# Altium schematic sheet 25.SchDoc
size 513 x 386 mm
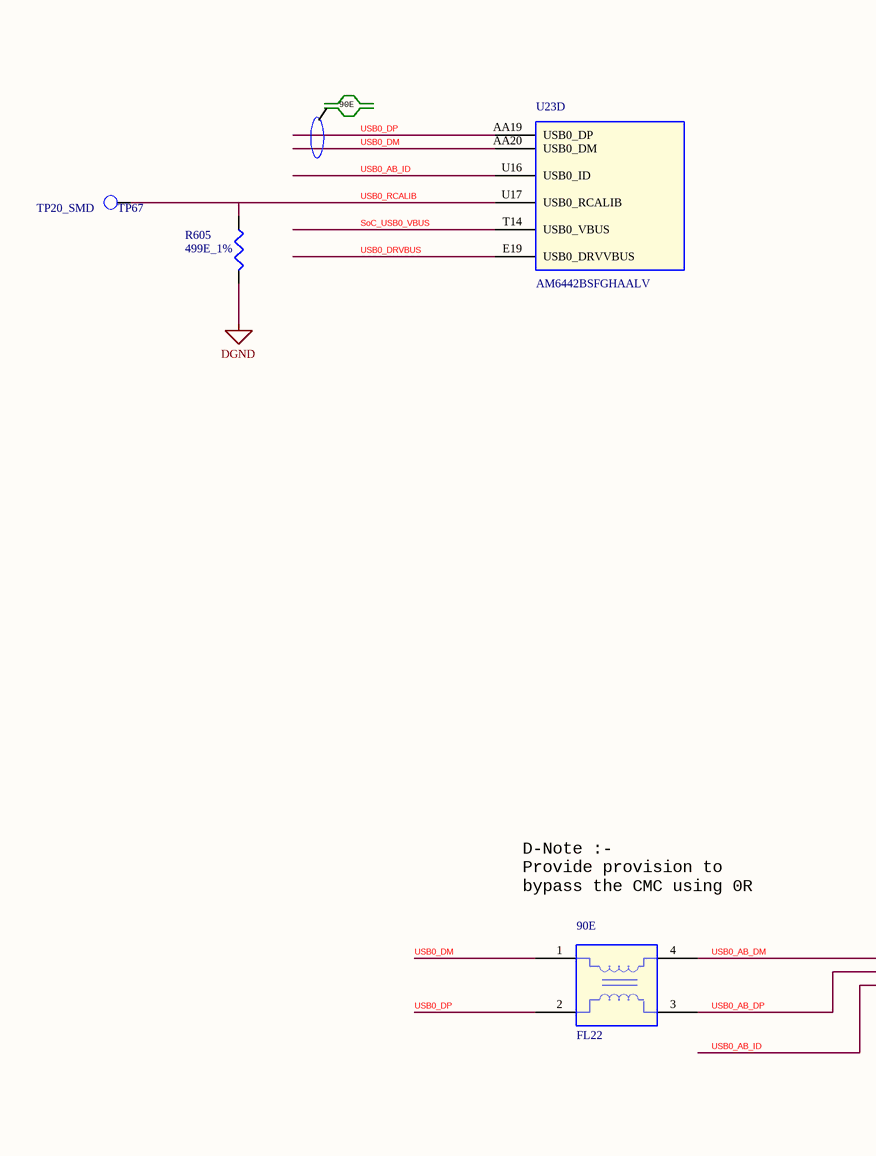
[diagram p0: 25.SchDoc, left]
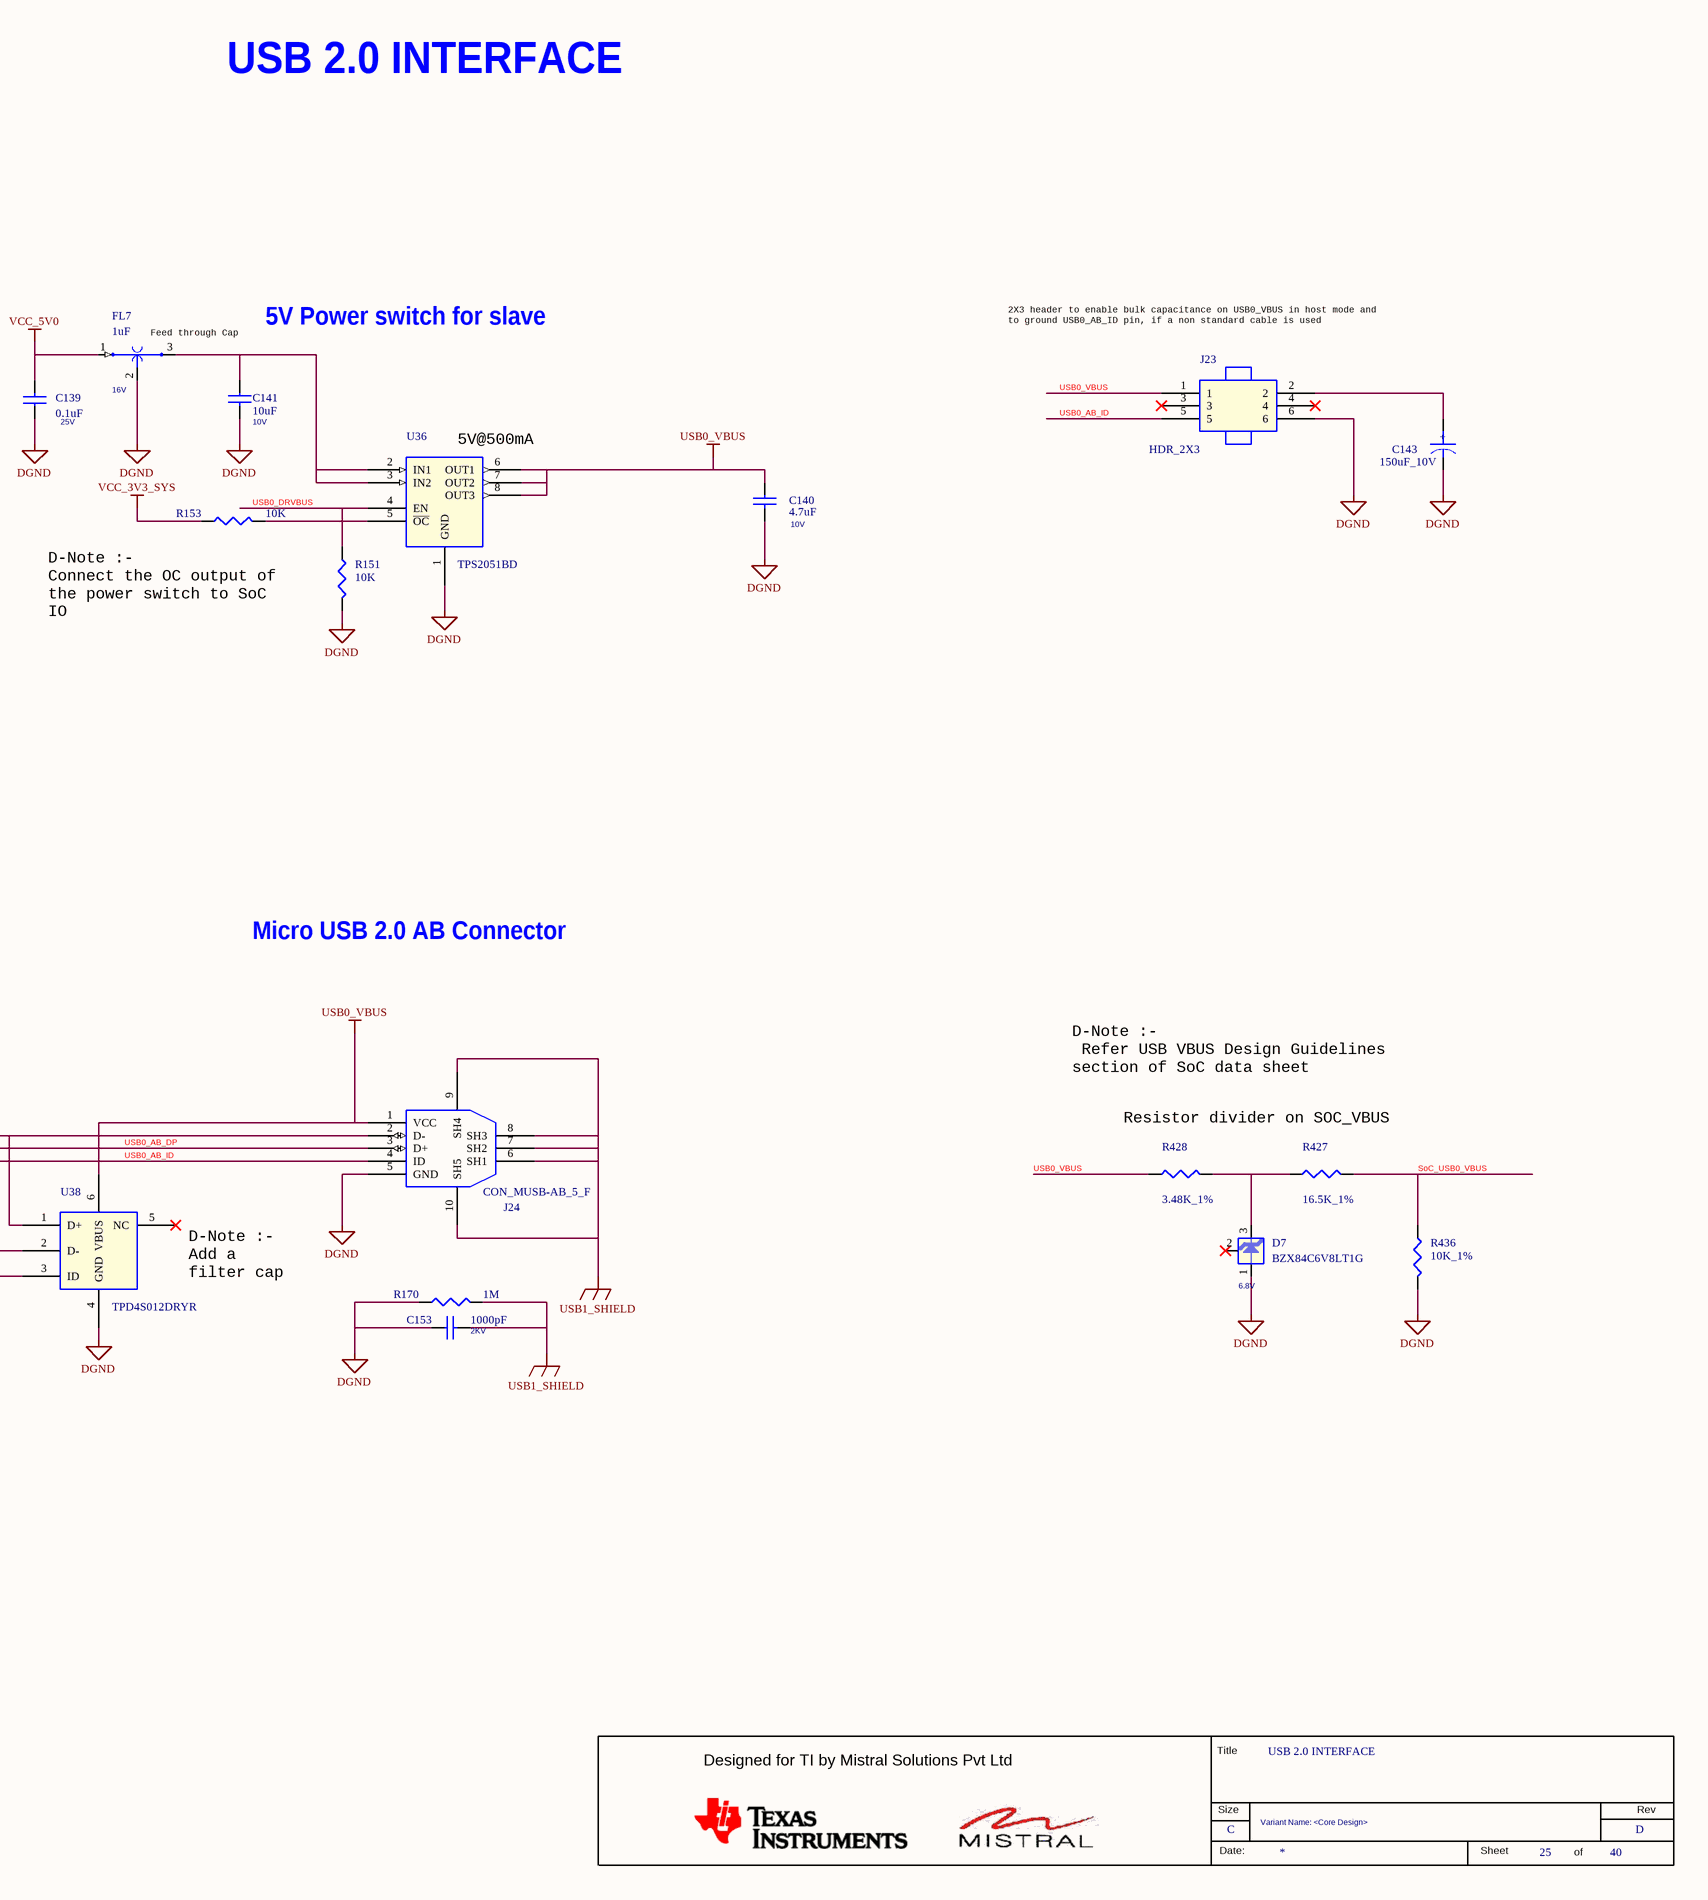
[diagram p1: 25.SchDoc, right]

## Parts
*  RevCode: D  Title: USB 2.0 INTERFACE  Page Size: C  Page Number: 25  Page Count: 40  Variant Name: <Core Design>  (hidden comment: MISTRAL_TITLEBLK_CSIZE)  (graphical)
C139  0.1uF  Voltage: 25V  [CAP0402_0-75]
C140  4.7uF  Voltage: 10V  [CAP0402_0-75]
C141  10uF  Voltage: 10V  [CAP0402_0-75]
C143  150uF_10V  [CAPT7343D_3-25]
C153  1000pF  Voltage: 2KV  [CAP1206_1-75]
D7  BZX84C6V8LT1G  Voltage: 6.8V  [SOT23-123_1-2]
FL7  1uF  Voltage: 16V  [FILT3_NFM21PC_0805_1]
FL22  90E  [IND4_ACM2012_90X50_SMD_1-3]
J23  HDR_2X3  [CON_3X2_SM_2MM]
J24  CON_MUSB-AB_5_F  [CON_USBAB5_ZX62RD-AB-5P8_S_R_S_3-2]
R151  10K  [RES0402_0-5]
R153  10K  [RES0402_0-5]
R170  1M  [RES0603_0-75]
R427  16.5K_1%  [RES0402_0-5]
R428  3.48K_1%  [RES0402_0-5]
R436  10K_1%  [RES0402_0-5]
R605  499E_1%  [RES0402_0-5]
TP67  TP20_SMD  [TP20_SMD]
U23  AM6442BSFGHAALV  [FCBGA441_31-49_680X680_2-6]  (part D of 16)
U36  TPS2051BD  [SOIC8_1-8]
U38  TPD4S012DRYR  [SON6_SN74LVC2G17_40X60_0-6]

## Nets
DGND: C139.1 C140.2 C141.2 C143.2 C153.1 D7.1(A) FL7.2(GND) J23.6 J24.5(GND) R151.2 R170.1 R436.2 R605.2 U36.1(GND) U38.4(GND)
USB0_VBUS: C140.1 J23.1 J24.1(VCC) R428.1 U36.6(OUT1) U36.7(OUT2) U36.8(OUT3) U38.6(VBUS)
USB1_SHIELD: C153.2 J24.6(SH1) J24.7(SH2) J24.8(SH3) J24.9(SH4) J24.10(SH5) R170.2
VCC_3V3_SYS: R153.1
VCC_5V0: C139.2 FL7.1(INPUT)
SoC_USB0_VBUS: R427.2 R436.1 U23.T14(USB0_VBUS)
USB0_AB_DM: FL22.4 J24.2(D-) U38.1(D+)
USB0_AB_DP: FL22.3 J24.3(D+) U38.2(D-)
USB0_AB_ID: J23.5 J24.4(ID) U23.U16(USB0_ID) U38.3(ID)
USB0_DM: FL22.1 U23.AA20(USB0_DM)
USB0_DP: FL22.2 U23.AA19(USB0_DP)
USB0_DRVBUS: R151.1 U23.E19(USB0_DRVVBUS) U36.4(EN)
USB0_RCALIB: R605.1 TP67.1(TP) U23.U17(USB0_RCALIB)
NetC141_1: C141.1 FL7.3(OUTPUT) U36.2(IN1) U36.3(IN2)
NetC143_1: C143.1 J23.2
NetD7_3: D7.3(C) R427.1 R428.2
NetR153_2: R153.2 U36.5(~{OC})

Not connected (* = marked no-connect by the designer): D7 2(NC)*; J23 3* 4*; U38 5(NC)*

## Notes on the sheet
- USB 2.0 INTERFACE
- 2X3 header to enable bulk capacitance on USB0_VBUS in host mode and
  to ground USB0_AB_ID pin, if a non standard cable is used
- 90E
- (near FL7) Feed through Cap
- 5V Power switch for slave
- (near U36) 5V@500mA
- (near R153) D-Note :-
  Connect the OC output of
  the power switch to SoC
  IO
- Micro USB 2.0 AB Connector
- D-Note :-
  Provide provision to
  bypass the CMC using 0R
- D-Note :-
  Refer USB VBUS Design Guidelines
  section of SoC data sheet
- Resistor divider on SOC_VBUS
- D-Note :-
  Add a
  filter cap
- (in symbol CAP_POL_Dup1) +
- (in symbol MISTRAL_TITLEBLK_CSIZE) Title; Designed for TI by Mistral Solutions Pvt Ltd; Size; Rev; Date:; Sheet; of

## Library data of the parts
* = MISTRAL_TITLEBLK_CSIZE: Issue: 1.0; Page Create Date: March  8, 1995; Page Modify Date: *
C139 = CAP_Dup3: CAP CERAMIC 0.1uF 25V 20% X5R 0402; Alt_Mfr_part_number: CC0402KRX5R8BB104; Mistral Part No: 120020080003-R; Mfr_name: WURTH ELECTRONICS; Mfr_part_number: 885012105018; Part_type: CAPACITORS\CERAMIC; Alt_Mfr_name: YAGEO AMERICA; Project: AM64x_EVM_BRD; Wattage: NA; Customs_HS_Code: 85322990; Custom_Duty: 15%; PCB Footprint: CAP0402_0-75; Tolerance: 20%; Package: 0402; Distributor_name: DIGIKEY; Distributor_part_number: 732-7495-1-ND; Height: 0.55MM; Weight: 0.65mg; Temperature: -55癈+85癈; Datasheet: Y:\MIS_DATABASE\DATASHEETS\CAPACITORS\885012105018.PDF; Crtd /date: ALVY/170820; Chkd/date: MANIRAJA/170820; MECHANICAL 3D STEP FILE: CAP0402_0-75; Library Ref: CAP; Footprint Ref: CAP0402_0-75; Library Path: Y:\MIS_DATABASE\Library\ALTIUM_TOOL\SCHEMATICS_PARTS\MS_DISCRETE_Library.schlib; Footprint Path: Y:\MIS_DATABASE\Library\ALTIUM_TOOL\PCB_FOOTPRINTS\Altium_Footprint_Lib.PcbLib
C140 = CAP_Dup3: CAP CERAMIC 4.7uF 10V 20% X5R 0402; Mistral Part No: 120012060002-R; Mfr_name: AVX CORPORATION; Mfr_part_number: 0402ZD475MAT2A; Part_type: CAPACITORS\CERAMIC; Project: TI_MAXIE_CPB; Wattage: NA; Customs_HS_Code: 85322990; Custom_Duty: 15%; PCB Footprint: CAP0402_0-75; Footprint Path: Y:\MIS_DATABASE\Library\ALTIUM_TOOL\PCB_FOOTPRINTS\Altium_Footprint_Lib.PcbLib; Library Path: Y:\MIS_DATABASE\Library\ALTIUM_TOOL\SCHEMATICS_PARTS\MS_DISCRETE_Library.schlib; Footprint Ref: CAP0402_0-75; Tolerance: 20%; Package: 0402; Distributor_name: DIGIKEY; Distributor_part_number: 478-10791-1-ND; Height: 0.71MM; Weight: 0.65mg; Temperature: -55癈+85癈; Datasheet: Y:\MIS_DATABASE\DATASHEETS\CAPACITORS\AVX_MLC.PDF; Crtd /date: MANIRAJA/230118; Chkd/date: MANIRAJA/230118; MECHANICAL 3D STEP FILE: CAP0402_0-75; Library Ref: CAP
C141 = CAP_Dup3: CAP CERAMIC 10uF 10V 20% X5R 0402; Mistral Part No: 120013110019-R; Mfr_name: MURATA; Mfr_part_number: GRM155R61A106ME11D; Part_type: CAPACITORS\CERAMIC; Project: QCS610_NANOSOM; Customs_HS_Code: 85322990; Custom_Duty: 15%; Wattage: NA; PCB Footprint: CAP0402_0-75; Library Ref: CAP; Tolerance: 20%; Package: 0402; Distributor_name: DIGIKEY; Distributor_part_number: 490-GRM155R61A106ME11DTR-ND; Height: 0.55MM; Datasheet: Y:\MIS_DATABASE\DATASHEETS\CAPACITORS\MURATA-GXX-SER_NOV17.PDF; Crtd /date: ALVY/260520; Chkd/date: MANIRAJA/300520; Weight: 3.1mg; Temperature: -55癈+85癈; MECHANICAL 3D STEP FILE: CAP0402_0-75; Footprint Ref: CAP0402_0-75; Library Path: Y:\MIS_DATABASE\Library\ALTIUM_TOOL\SCHEMATICS_PARTS\MS_DISCRETE_Library.schlib; Footprint Path: Y:\MIS_DATABASE\Library\ALTIUM_TOOL\PCB_FOOTPRINTS\Altium_Footprint_Lib.PcbLib
C143 = CAP_POL_Dup1: CAP TANTALUM 150uF 10V 10% ESR 0.9E D7343; Part_type: CAPACITORS\TANTALUM; Mfr_part_number: TAJD157K010TNJV; Mfr_name: AVX CORPORATION; Mistral Part No: 120018010025-R; Custom_Duty: 15%; Customs_HS_Code: 85322990; Wattage: NA; Project: TI_MAXIE_CPB; Footprint Path: Y:\MIS_DATABASE\Library\ALTIUM_TOOL\PCB_FOOTPRINTS\Altium_Footprint_Lib.PcbLib; Library Path: Y:\MIS_DATABASE\Library\ALTIUM_TOOL\SCHEMATICS_PARTS\MS_DISCRETE_Library.schlib; Footprint Ref: CAPT7343D_3-25; MECHANICAL 3D STEP FILE: CAPT7343D_3-25; Chkd/date: MANIRAJA/240118; Crtd /date: MANIRAJA/240118; Datasheet: Y:\MIS_DATABASE\DATASHEETS\CAPACITORS\AVX-TAJ-SER.PDF; Temperature: -55癈+125癈; Weight: 670mg; Height: 3.10MM; Distributor_part_number: 478-11241-1-ND; Distributor_name: DIGIKEY; Package: D7343; Voltage: 10V; Tolerance: 10%; Library Ref: CAP_POL; PCB Footprint: CAPT7343D_3-25
C153 = CAP_Dup3: CAP CERAMIC 1000pF 2KV 10% X7R 1206; Part_type: CAPACITORS\CERAMIC; Mfr_part_number: 1206GC102KAT1A; Mfr_name: AVX CORPORATION; Mistral Part No: 120015080006-R; Custom_Duty: 15%; Customs_HS_Code: 85322990; Project: ADR1B; Wattage: NA; PCB Footprint: CAP1206_1-75; Chkd/date: SHREESHAIL/291106; Crtd /date: MAZHAR/281106; Datasheet: Y:\MIS_DATABASE\DATASHEETS\CAPACITORS\AVX_HV-MLC.PDF; Temperature: -55癈+125癈; Weight: 16.2mg; Height: 1.52MM; Distributor_part_number: 478-2956-1-ND; Distributor_name: DIGIKEY; Package: 1206; Tolerance: 10%; Library Ref: CAP; Footprint Ref: CAP1206_1-75; Library Path: Y:\MIS_DATABASE\Library\ALTIUM_TOOL\SCHEMATICS_PARTS\MS_DISCRETE_Library.schlib; Footprint Path: Y:\MIS_DATABASE\Library\ALTIUM_TOOL\PCB_FOOTPRINTS\Altium_Footprint_Lib.PcbLib; MECHANICAL 3D STEP FILE: CAP1206_1-75
D7 = DIODE_ZENER_SOT23_13: DIODE ZENER 250mW 6.8V SOT23-123; Mistral Part No: 130017100002-R; Mfr_name: ON SEMICONDUCTOR; Part_type: DIODE\ZENER; Project: TI_MAXIE_CPB; Tolerance: NA; Customs_HS_Code: 85412900; Custom_Duty: 15%; Mfr_part_number: BZX84C6V8LT1G; Wattage: NA; Package: SOT23-123; Distributor_name: DIGIKEY; Distributor_part_number: BZX84C6V8LT1GOSCT-ND; Height: 1.11MM; Weight: 8mg; Temperature: -65癈+150癈; Datasheet: Y:\MIS_DATABASE\DATASHEETS\DISCRETES\DIODES\BZX84XX.PDF; Crtd /date: MANIRAJA/031017; Chkd/date: MANIRAJA/031017; MECHANICAL 3D STEP FILE: SOT23-123_1-2; Library Ref: DIODE_ZENER_SOT23_13; PCB Footprint: SOT23-123_1-2
FL7 = FILTER_NFM: PASSIVE FILTER EMI 1uF 16V 0805; Mistral Part No: 130016030041-R; Mfr_name: MURATA; Mfr_part_number: NFM21PC105B1C3D; Project: RCI_DLS_PS; Tolerance: NA; Customs_HS_Code: 85412900; Custom_Duty: 15%; Footprint Ref: FILT3_NFM21PC_0805_1; Part_type: FILTER; Wattage: NA; Package: 0805; Distributor_name: DIGIKEY; Distributor_part_number: 490-3912-1-ND; Library Ref: FILTER_NFM; PCB Footprint: FILT3_NFM21PC_0805_1; Height: 0.95MM; Weight: 12mg; Temperature: -40癈+85癈; Datasheet: Y:\MIS_DATABASE\DATASHEETS\DISCRETES\INDUCTORS\NFM21PC105B1C3.PDF; Crtd /date: JEBRAN/220316; Chkd/date: VASANTHA/140416; MECHANICAL 3D STEP FILE: FILT3_NFM21PC_0805_1; Library Path: Y:\MIS_DATABASE\Library\ALTIUM_TOOL\SCHEMATICS_PARTS\MS_FILTER_Library.schlib; Footprint Path: Y:\MIS_DATABASE\Library\ALTIUM_TOOL\PCB_FOOTPRINTS\Altium_Footprint_Lib.PcbLib
FL22 = EMIFILTER_ACM: PASSIVE FILTER COMMON MODE 90E 400mA SMD; Mistral Part No: 130009030803-R; Mfr_name: TDK CORPORATION; Mfr_part_number: ACM2012-900-2P-T002; Wattage: NA; Project: SMART VIEW_NVR; Customs_HS_Code: 85437099; Custom_Duty: 24%; MECHANICAL 3D STEP FILE: IND4_ACM2012_90X50_SMD_1-3; Temperature: -40癈+85癈; Weight: 5.5mg; Library Ref: EMIFILTER_ACM; Voltage: NA; Tolerance: NA; Part_type: FILTER; Package: SMD; Distributor_name: DIGIKEY; Distributor_part_number: 445-2207-1-ND; Height: 1.30MM; Datasheet: Y:\MIS_DATABASE\DATASHEETS\ICS\MISC\ACM2012-SER.PDF; Crtd /date: MAZHAR/270907; Chkd/date: MANIRAJA/130218; PCB Footprint: IND4_ACM2012_90X50_SMD_1-3
J23 = HEADER_3X2: CON HDR 2X3 2.54MM PITCH ST TH; Part_type: CONNECTOR\HEADERS; Mfr_part_number: TSW-103-07-T-D; Mfr_name: SAMTEC; Mistral Part No: 150018010019-R; OCT Option: G; MECHANICAL 3D STEP FILE: HDR_2X3_TSW-103-07-D_S_T_8-4; Custom_Duty: 24%; Customs_HS_Code: 85369090; Wattage: NA; Project: TI_MAXIE_CPB; Library Ref: HEADER_3X2; Chkd/date: MANIRAJA/230118; Crtd /date: MANIRAJA/220118; Datasheet: Y:\MIS_DATABASE\DATASHEETS\CONNECTORS\TSW-MK.PDF; Temperature: -55癈+105癈; Weight: NA; Height: 8.38MM; Distributor_part_number: SAM1034-03-ND; Distributor_name: DIGIKEY; Package: THRU-HOLE; Voltage: NA; Tolerance: NA; PCB Footprint: HDR_2X3_TSW-103-07-D_S_T_8-4
J24 = CON_USB_MINI-AB_10: CON MICRO USB-AB TYPE 5POS FEMALE RT SMD; Part_type: CONNECTOR\USB; Mfr_part_number: ZX62RD-AB-5P8(30); Mfr_name: HRS; Mistral Part No: 150010040003-R; Custom_Duty: 24%; Customs_HS_Code: 85369090; Wattage: NA; Project: ESEE; Footprint Path: Y:\MIS_DATABASE\Library\ALTIUM_TOOL\PCB_FOOTPRINTS\Altium_Footprint_Lib.PcbLib; Library Path: Y:\MIS_DATABASE\Library\ALTIUM_TOOL\SCHEMATICS_PARTS\MS_CONNECTOR_Library.schlib; MECHANICAL 3D STEP FILE: CON_USBAB5_ZX62RD-AB-5P8_S_R_S_3-2; Chkd/date: MANIRAJA/150620; Crtd /date: MUDDU/090410; Datasheet: Y:\MIS_DATABASE\DATASHEETS\CONNECTORS\ZX62RD-AB-5P8.PDF; Temperature: -30癈+85癈; Weight: NA; Height: 3.15MM; Library Ref: CON_USB_MINI-AB_10; Distributor_part_number: H125777CT-ND; Distributor_name: DIGIKEY; Package: SMD; Voltage: NA; Tolerance: NA; Footprint Ref: CON_USBAB5_ZX62RD-AB-5P8_S_R_S_3-2; PCB Footprint: CON_USBAB5_ZX62RD-AB-5P8_S_R_S_3-2
R151 R153 = RESISTOR_Dup6: RES 10K 1/16W 5% 0402; Part_type: RESISTORS\FIXED; Mfr_part_number: RC0402JR-0710KL; Mfr_name: YAGEO AMERICA; Mistral Part No: 110011060021-R; Custom_Duty: 15%; Customs_HS_Code: 85332119; Voltage: NA; Project: HSE; Footprint Path: Y:\MIS_DATABASE\Library\ALTIUM_TOOL\PCB_FOOTPRINTS\Altium_Footprint_Lib.PcbLib; Library Path: Y:\MIS_DATABASE\Library\ALTIUM_TOOL\SCHEMATICS_PARTS\MS_DISCRETE_Library.schlib; Footprint Ref: RES0402_0-5; Library Ref: RESISTOR; MECHANICAL 3D STEP FILE: RES0402_0-5; Chkd/date: VASANTHA/061216; Crtd /date: MAZHAR/230805; Datasheet: Y:\MIS_DATABASE\DATASHEETS\RESISTORS\RCXXXXL-SER_MAR18.PDF; Temperature: -55癈+155癈; Weight: 0.65mg; Height: 0.40MM; Distributor_part_number: 311-10KJRCT-ND; Distributor_name: DIGIKEY; Package: 0402; Wattage: 1/16W; Tolerance: 5%; PCB Footprint: RES0402_0-5
R170 = RESISTOR_Dup6: RES 1M 1/10W 5% 0603; Mistral Part No: 110009030413-R; Mfr_name: PANASONIC-ECG; Mfr_part_number: ERJ-3GEYJ105V; Part_type: RESISTORS\FIXED; Project: BSN; Voltage: NA; Customs_HS_Code: 85332119; Custom_Duty: 15%; Footprint Path: Y:\MIS_DATABASE\Library\ALTIUM_TOOL\PCB_FOOTPRINTS\Altium_Footprint_Lib.PcbLib; Library Path: Y:\MIS_DATABASE\Library\ALTIUM_TOOL\SCHEMATICS_PARTS\MS_DISCRETE_Library.schlib; Footprint Ref: RES0603_0-75; Library Ref: RESISTOR; Tolerance: 5%; Wattage: 1/10W; Package: 0603; Distributor_name: DIGIKEY; Distributor_part_number: P1.0MGCT-ND; Height: 0.55MM; Weight: 2mg; Temperature: -55癈+155癈; Datasheet: Y:\MIS_DATABASE\DATASHEETS\RESISTORS\PAN-ERJSER_NOV17.PDF; Crtd /date: USMAN/111207; Chkd/date: VASANTHA/060217; MECHANICAL 3D STEP FILE: RES0603_0-75; PCB Footprint: RES0603_0-75
R427 = RESISTOR_Dup1: RES 16.5K 1/16W 1% 0402; Part_type: RESISTORS\FIXED; Mfr_part_number: RC0402FR-0716K5L; Mfr_name: YAGEO AMERICA; Mistral Part No: 110020120011-R; Custom_Duty: 15%; Customs_HS_Code: 85332119; Voltage: NA; Project: TI_AM243x LP EVM; Footprint Path: Y:\MIS_DATABASE\Library\ALTIUM_TOOL\PCB_FOOTPRINTS\Altium_Footprint_Lib.PcbLib; Library Path: Y:\MIS_DATABASE\Library\ALTIUM_TOOL\SCHEMATICS_PARTS\MS_DISCRETE_Library.schlib; MECHANICAL 3D STEP FILE: RES0402_0-5; Chkd/date: ALVY/091220; Crtd /date: MANIRAJA/091220; Datasheet: Y:\MIS_DATABASE\DATASHEETS\RESISTORS\RCXXXXL-SER_MAR18.PDF; Temperature: -55癈+155癈; Weight: 0.65mg; Height: 0.40MM; Library Ref: RESISTOR; Distributor_part_number: YAG3002CT-ND; Distributor_name: DIGIKEY; Package: 0402; Wattage: 1/16W; Tolerance: 1%; Footprint Ref: RES0402_0-5; PCB Footprint: RES0402_0-5
R428 = RESISTOR_Dup1: RES 3.48K 1/16W 1% 0402; Part_type: RESISTORS\FIXED; Mfr_part_number: RC0402FR-073K48L; Mfr_name: YAGEO AMERICA; Mistral Part No: 110019120035-R; Custom_Duty: 15%; Customs_HS_Code: 85332119; Voltage: NA; Project: TI_AM243x LP EVM; Footprint Path: Y:\MIS_DATABASE\Library\ALTIUM_TOOL\PCB_FOOTPRINTS\Altium_Footprint_Lib.PcbLib; Library Path: Y:\MIS_DATABASE\Library\ALTIUM_TOOL\SCHEMATICS_PARTS\MS_DISCRETE_Library.schlib; MECHANICAL 3D STEP FILE: RES0402_0-5; Chkd/date: ALVY/091220; Crtd /date: MANIRAJA/091220; Datasheet: Y:\MIS_DATABASE\DATASHEETS\RESISTORS\RCXXXXL-SER_MAR18.PDF; Temperature: -55癈+155癈; Weight: 0.65mg; Height: 0.40MM; Library Ref: RESISTOR; Distributor_part_number: YAG3148CT-ND; Distributor_name: DIGIKEY; Package: 0402; Wattage: 1/16W; Tolerance: 1%; Footprint Ref: RES0402_0-5; PCB Footprint: RES0402_0-5
R436 = RESISTOR_Dup6: RES 10K 1/16W 1% 0402; Part_type: RESISTORS\FIXED; Mfr_part_number: RC0402FR-0710KL; Mfr_name: YAGEO AMERICA; Mistral Part No: 110015090015-R; Custom_Duty: 15%; Customs_HS_Code: 85332119; Voltage: NA; Project: VOCERA; Chkd/date: VASANTHA/201216; Crtd /date: GEETHA/290506; Datasheet: Y:\MIS_DATABASE\DATASHEETS\RESISTORS\RCXXXXL-SER_MAR18.PDF; Temperature: -55癈+155癈; Weight: 0.65mg; Height: 0.40MM; Distributor_part_number: 311-10.0KLRTR-ND; Distributor_name: DIGIKEY; Package: 0402; Wattage: 1/16W; Tolerance: 1%; MECHANICAL 3D STEP FILE: RES0402_0-5; Library Ref: RESISTOR; Footprint Ref: RES0402_0-5; Library Path: Y:\MIS_DATABASE\Library\ALTIUM_TOOL\SCHEMATICS_PARTS\MS_DISCRETE_Library.schlib; Footprint Path: Y:\MIS_DATABASE\Library\ALTIUM_TOOL\PCB_FOOTPRINTS\Altium_Footprint_Lib.PcbLib; PCB Footprint: RES0402_0-5
R605 = RESISTOR_Dup6: RES 499E 1/16W 1% 0402; Part_type: RESISTORS\FIXED; Mfr_part_number: RC0402FR-07499RL; Mfr_name: YAGEO AMERICA; Mistral Part No: 110020080006-R; Custom_Duty: 15%; Customs_HS_Code: 85332119; Voltage: NA; Project: AM64XX_EVM; PCB Footprint: RES0402_0-5; Footprint Path: Y:\MIS_DATABASE\Library\ALTIUM_TOOL\PCB_FOOTPRINTS\Altium_Footprint_Lib.PcbLib; Library Path: Y:\MIS_DATABASE\Library\ALTIUM_TOOL\SCHEMATICS_PARTS\MS_DISCRETE_Library.schlib; MECHANICAL 3D STEP FILE: RES0402_0-5; Chkd/date: MANIRAJA/051020; Crtd /date: ALVY/051020; Datasheet: Y:\MIS_DATABASE\DATASHEETS\RESISTORS\RCXXXXL-SER_MAR18.PDF; Temperature: -55癈+155癈; Weight: 0.65mg; Height: 0.40MM; Footprint Ref: RES0402_0-5; Library Ref: RESISTOR; Distributor_part_number: 311-499LRCT-ND; Distributor_name: DIGIKEY; Package: 0402; Wattage: 1/16W; Tolerance: 1%
TP67 = TESTPOINT: TESTPOINT CIR 20 SMD; Mfr_name: LOCAL; MECHANICAL 3D STEP FILE: NA; Project: BT MODULE_CSRBC04; PCB Footprint: TP20_SMD; RoHS: NA; Footprint Ref: TP20_SMD; Library Ref: TESTPOINT; Footprint Path: Y:\MIS_DATABASE\Library\ALTIUM_TOOL\PCB_FOOTPRINTS\Altium_Footprint_Lib.PcbLib; Library Path: Y:\MIS_DATABASE\Library\ALTIUM_TOOL\SCHEMATICS_PARTS\MS_DISCRETE_Library.schlib; Datasheet: NA; Temperature: NA; Weight: NA; Wattage: NA; Voltage: NA; Tolerance: NA; Chkd/date: SHREESHAIL/171006; Crtd /date: MAZHAR/171006; Height: NA; Distributor_part_number: NA; Distributor_name: NA; Package: SMD; Part_type: TESTPOINT; Mfr_part_number: TP20_SMD; Mistral Part No: NA; Customs_HS_Code: NA; Custom_Duty: NA
U23 = XAM6442BSFGGAALV_BGA441: IC AM64x SoC MICROPROCESSOR BGA441; Part_type: ICS\DIGITAL\MICROPROCESSOR; Mfr_name: TEXAS INSTRUMENTS; Mistral Part No: 141220080002; Custom_Duty: 15%; Customs_HS_Code: 85423100; Wattage: NA; Project: AM64x-GP_EVM BRD; Footprint Path: Y:\MIS_DATABASE\Library\ALTIUM_TOOL\PCB_FOOTPRINTS\Altium_Footprint_Lib.PcbLib; Library Path: Y:\MIS_DATABASE\Library\ALTIUM_TOOL\SCHEMATICS_PARTS\MS_MICROPROCESSOR_Library.schlib; MECHANICAL 3D STEP FILE: FCBGA441_31-49_680X680_2-6; RoHS: NA; Chkd/date: ALVY/300322; Crtd /date: ALVY/300322; Datasheet: Y:\MIS_DATABASE\DATASHEETS\ICS\DIGITAL\MICROCONTROLLER\AM64-SoC_SVB.PDF; Temperature: NA; Weight: NA; Height: 2.57MM; Library Ref: XAM6442BSFGGAALV_BGA441; Distributor_part_number: NA; Distributor_name: NA; Package: BGA441; Voltage: NA; Tolerance: NA; Mfr_part_number: AM6442BSFGHAALV; Footprint Ref: FCBGA441_31-49_680X680_2-6; PCB Footprint: FCBGA441_31-49_680X680_2-6
U36 = TPS2051BD_SOIC8: IC POWER DISTRIBUTION SWITCH SOIC8; Part_type: ICS\POWER; Mfr_name: TEXAS INSTRUMENTS; Mistral Part No: 142014060011-R; Custom_Duty: 15%; Customs_HS_Code: 85423100; Wattage: NA; Project: AEGIS_POM; Chkd/date: NAVEED/150714; Crtd /date: VASANTHA/190614; Datasheet: Y:\MIS_DATABASE\DATASHEETS\MISC\REGULATORS\TPS2051BDBVR.PDF; Temperature: -40癈+125癈; Weight: 72.6mg; Height: 1.75MM; Distributor_part_number: 296-26911-5-ND; Distributor_name: DIGIKEY; Package: SOIC8; Voltage: NA; Tolerance: NA; Mfr_part_number: TPS2051BD; Library Ref: TPS2051BD_SOIC8; Footprint Ref: SOIC8_1-8; MECHANICAL 3D STEP FILE: SOIC8_1-8; Library Path: Y:\MIS_DATABASE\Library\ALTIUM_TOOL\SCHEMATICS_PARTS\MS_MISCPOWER_Library.schlib; Footprint Path: Y:\MIS_DATABASE\Library\ALTIUM_TOOL\PCB_FOOTPRINTS\Altium_Footprint_Lib.PcbLib; PCB Footprint: SOIC8_1-8
U38 = TPD4S012DRY_SON6: IC 4CH ESD SOLUTION FOR USB-HS/USB OTG/USB CHARGER INTERFACE SON6; Mistral Part No: 141011080022-R; Mfr_name: TEXAS INSTRUMENTS; Part_type: ICS\INTERFACE; Project: ACRO_DM3730; Tolerance: NA; Customs_HS_Code: 85423100; Custom_Duty: 15%; Footprint Path: Y:\MIS_DATABASE\Library\ALTIUM_TOOL\PCB_FOOTPRINTS\Altium_Footprint_Lib.PcbLib; Library Path: Y:\MIS_DATABASE\Library\ALTIUM_TOOL\SCHEMATICS_PARTS\MS_MISCINTERFACE_Library.schlib; Footprint Ref: SON6_SN74LVC2G17_40X60_0-6; Library Ref: TPD4S012DRY_SON6; Mfr_part_number: TPD4S012DRYR; Voltage: NA; Wattage: NA; Package: SON6; Distributor_name: DIGIKEY; Distributor_part_number: 296-24244-1-ND; Height: 0.60MM; Weight: 3.2mg; Temperature: -40癈+85癈; Datasheet: Y:\MIS_DATABASE\DATASHEETS\ICS\INTERFACE\TPD4S012DRYR.PDF; Crtd /date: BAVISH/190811; Chkd/date: MANIRAJA/040719; MECHANICAL 3D STEP FILE: SON6_SN74LVC2G17_40X60_0-6; PCB Footprint: SON6_SN74LVC2G17_40X60_0-6